# Altium project iA-Pmod-AES3-4x4.PrjPcb (part 1 of 2)
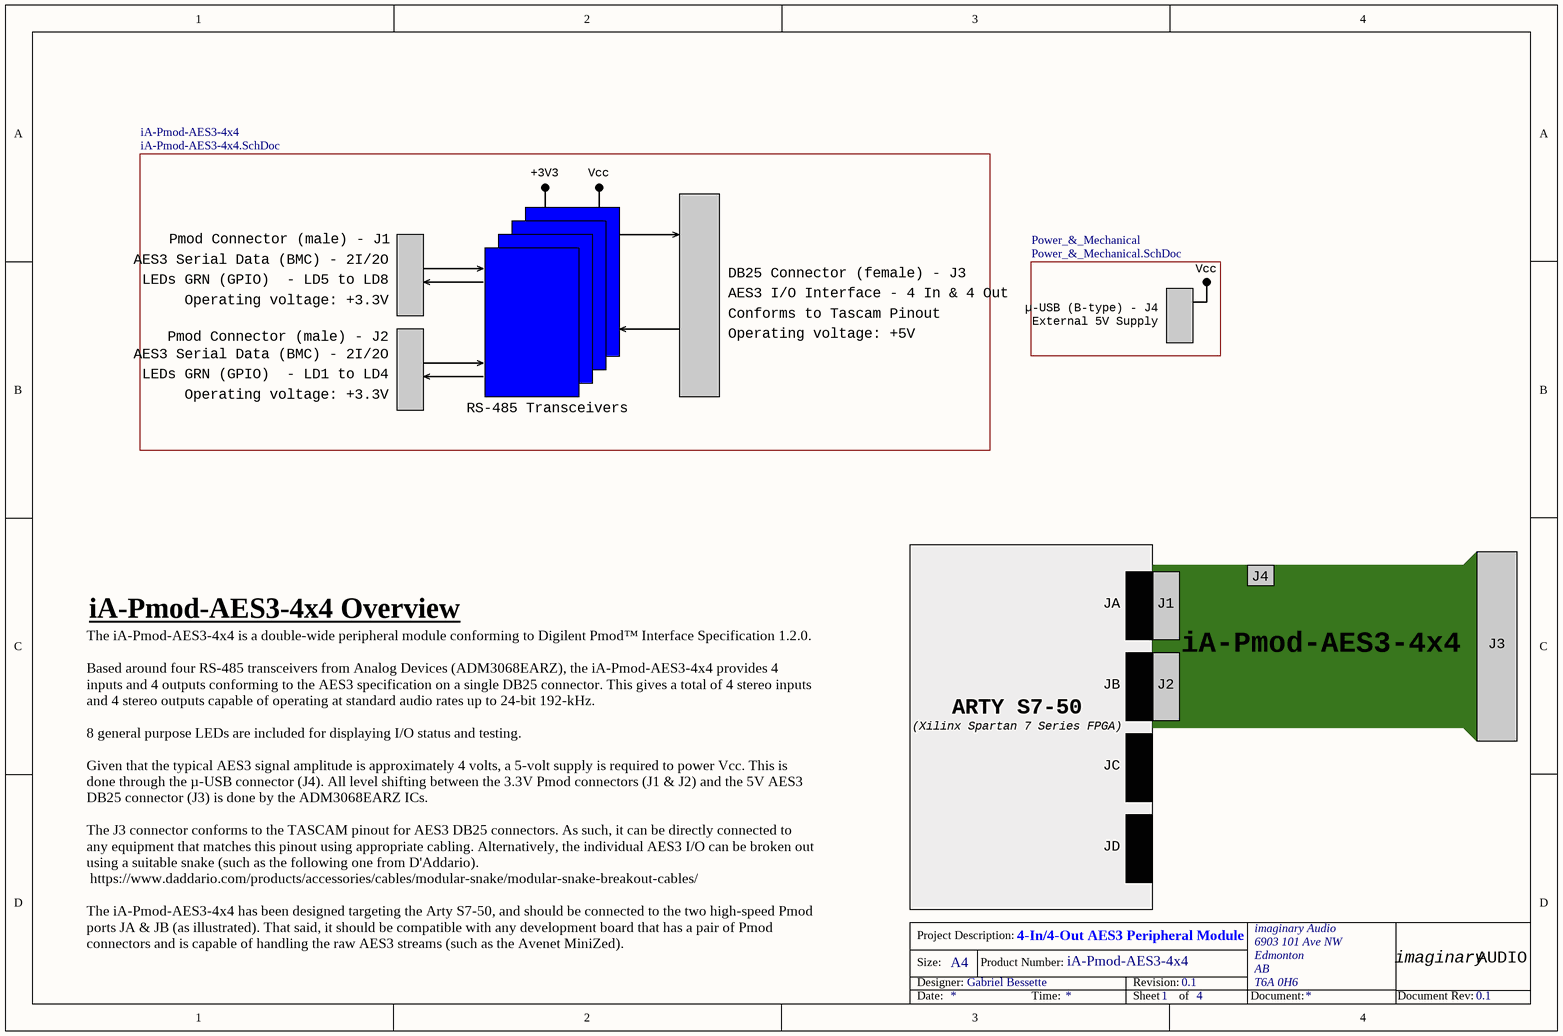
[diagram p0: iA-Pmod-AES3-4x4_Overview.SchDoc]
PartNumberPCBA: iA-Pmod-AES3-4x4; ProductNumber: iA-Pmod-AES3-4x4; ProductRevision: 0.1; ProjectDescription: 4-In/4-Out AES3 Peripheral Module
4 sheets, 124 parts. Net scope: flat (ports and power ports of the same name join across sheets).
Board file: iA-Pmod-AES3-4x4.PcbDoc
Sheets:
  iA-Pmod-AES3-4x4_Overview.SchDoc
    iA-Pmod-AES3-4x4 = iA-Pmod-AES3-4x4.SchDoc
      IO1 = AES3_Transceiver.SchDoc
      IO2 = AES3_Transceiver.SchDoc
      IO3 = AES3_Transceiver.SchDoc
      IO4 = AES3_Transceiver.SchDoc
    Power_&_Mechanical = Power_&_Mechanical.SchDoc

## Sheet iA-Pmod-AES3-4x4_Overview.SchDoc
size A4; CompanyName: imaginary Audio; Organization: imaginary Audio; Address1: 6903 101 Ave NW; Address2: Edmonton; Address3: AB; Address4: T6A 0H6; DocumentNumber: 1; Revision: 0.1; SheetNumber: 1; SheetTotal: 4; Designer: Gabriel Bessette; DocRev: 0.1

### Sub-sheets
iA-Pmod-AES3-4x4 = iA-Pmod-AES3-4x4.SchDoc: no entries
Power_&_Mechanical = Power_&_Mechanical.SchDoc: no entries

### Notes on the sheet
- +3V3
- Vcc
- Pmod Connector (male) - J1
- AES3 Serial Data (BMC) - 2I/2O
- Operating voltage: +3.3V
- LEDs GRN (GPIO)  - LD5 to LD8
- DB25 Connector (female) - J3
- AES3 I/O Interface - 4 In & 4 Out
- µ-USB (B-type) - J4
- Pmod Connector (male) - J2
- LEDs GRN (GPIO)  - LD1 to LD4
- Conforms to Tascam Pinout
- Operating voltage: +5V
- External 5V Supply
- RS-485 Transceivers
- J4
- iA-Pmod-AES3-4x4 Overview
- JA
- J1
- iA-Pmod-AES3-4x4
- J3
- ARTY S7-50
- JB
- J2
- (Xilinx Spartan 7 Series FPGA)
- JC
- JD
- The iA-Pmod-AES3-4x4 is a double-wide peripheral module conforming to Digilent Pmod™ Interface Specification 1.2.0.
  Based around four RS-485 transceivers from Analog Devices (ADM3068EARZ), the iA-Pmod-AES3-4x4 provides 4 inputs and 4 outputs conforming to the AES3 specification on a single DB25 connector. This gives a total of 4 stereo inputs and 4 stereo outputs capable of operating at standard audio rates up to 24-bit 192-kHz.
  8 general purpose LEDs are included for displaying I/O status and testing.
  Given that the typical AES3 signal amplitude is approximately 4 volts, a 5-volt supply is required to power Vcc. This is done through the µ-USB connector (J4). All level shifting between the 3.3V Pmod connectors (J1 & J2) and the 5V AES3 DB25 connector (J3) is done by the ADM3068EARZ ICs.
  The J3 connector conforms to the TASCAM pinout for AES3 DB25 connectors. As such, it can be directly connected to any equipment that matches this pinout using appropriate cabling. Alternatively, the individual AES3 I/O can be broken out using a suitable snake (such as the following one from D'Addario).
  https://www.daddario.com/products/accessories/cables/modular-snake/modular-snake-breakout-cables/
  The iA-Pmod-AES3-4x4 has been designed targeting the Arty S7-50, and should be connected to the two high-speed Pmod ports JA & JB (as illustrated). That said, it should be compatible with any development board that has a pair of Pmod connectors and is capable of handling the raw AES3 streams (such as the Avenet MiniZed).
- Project Description:
- Size:
- Designer:
- A4
- Product Number:
- Revision:
- imaginary
- AUDIO
- Date:
- Time:
- Sheet
- of
- Document:
- Document Rev:

## Sheet iA-Pmod-AES3-4x4.SchDoc
size A4; CompanyName: imaginary Audio; Organization: imaginary Audio; Address1: 6903 101 Ave NW; Address2: Edmonton; Address3: AB; Address4: T6A 0H6; DocumentNumber: 2; Revision: 0.1; SheetNumber: 2; SheetTotal: 4; Designer: Gabriel Bessette; DocRev: 0.1
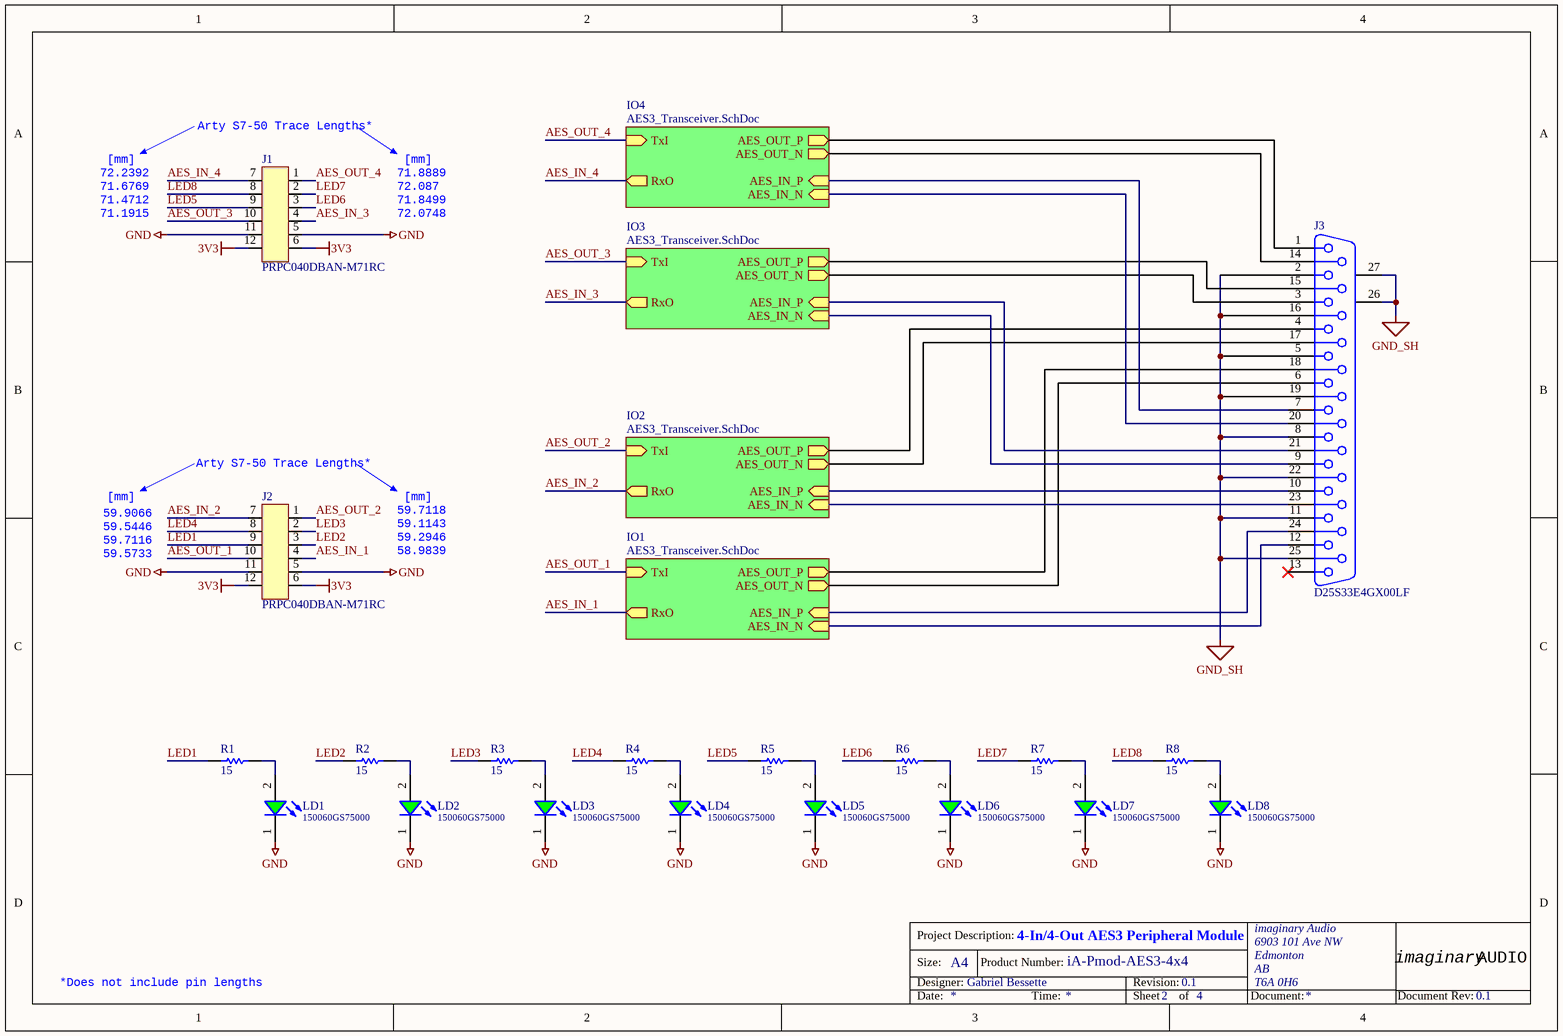
[diagram p1: iA-Pmod-AES3-4x4.SchDoc]

### Parts
J1  PRPC040DBAN-M71RC  [HDRMTH100RA_6x2]
J2  PRPC040DBAN-M71RC  [HDRMTH100RA_6x2]
J3  D25S33E4GX00LF  [D25S33E4GX00LF]
LD1  150060GS75000  [WL-SMCW_0603_H=0.7mm]
LD2  150060GS75000  [WL-SMCW_0603_H=0.7mm]
LD3  150060GS75000  [WL-SMCW_0603_H=0.7mm]
LD4  150060GS75000  [WL-SMCW_0603_H=0.7mm]
LD5  150060GS75000  [WL-SMCW_0603_H=0.7mm]
LD6  150060GS75000  [WL-SMCW_0603_H=0.7mm]
LD7  150060GS75000  [WL-SMCW_0603_H=0.7mm]
LD8  150060GS75000  [WL-SMCW_0603_H=0.7mm]
R1  15  [RESC1608X55X30NL15T15]
R2  15  [RESC1608X55X30NL15T15]
R3  15  [RESC1608X55X30NL15T15]
R4  15  [RESC1608X55X30NL15T15]
R5  15  [RESC1608X55X30NL15T15]
R6  15  [RESC1608X55X30NL15T15]
R7  15  [RESC1608X55X30NL15T15]
R8  15  [RESC1608X55X30NL15T15]

### Sub-sheets
IO1 = AES3_Transceiver.SchDoc: AES_IN_P (in), AES_IN_N (in), AES_OUT_N (out), AES_OUT_P (out), TxI (in), RxO (out)
IO2 = AES3_Transceiver.SchDoc: AES_IN_P (in), AES_IN_N (in), AES_OUT_N (out), AES_OUT_P (out), TxI (in), RxO (out)
IO3 = AES3_Transceiver.SchDoc: AES_IN_P (in), AES_IN_N (in), AES_OUT_N (out), AES_OUT_P (out), TxI (in), RxO (out)
IO4 = AES3_Transceiver.SchDoc: AES_IN_P (in), AES_IN_N (in), AES_OUT_N (out), AES_OUT_P (out), TxI (in), RxO (out)

### Nets
3V3: J1.6 J1.12 J2.6 J2.12
GND: J1.5 J1.11 J2.5 J2.11 LD1.1(K) LD2.1(K) LD3.1(K) LD4.1(K) LD5.1(K) LD6.1(K) LD7.1(K) LD8.1(K)
GND_SH: J3.2 J3.5 J3.8 J3.11 J3.16 J3.19 J3.22 J3.25 J3.26(MH1) J3.27(MH2)
AES_IN_1: J2.4 ; sheet IO1/RxO
AES_IN_2: J2.7 ; sheet IO2/RxO
AES_IN_3: J1.4 ; sheet IO3/RxO
AES_IN_4: J1.7 ; sheet IO4/RxO
AES_OUT_1: J2.10 ; sheet IO1/TxI
AES_OUT_2: J2.1 ; sheet IO2/TxI
AES_OUT_3: J1.10 ; sheet IO3/TxI
AES_OUT_4: J1.1 ; sheet IO4/TxI
LED1: J2.9 R1.1
LED2: J2.3 R2.1
LED3: J2.2 R3.1
LED4: J2.8 R4.1
LED5: J1.9 R5.1
LED6: J1.3 R6.1
LED7: J1.2 R7.1
LED8: J1.8 R8.1
NetJ3_1: J3.1 ; sheet IO4/AES_OUT_P
NetJ3_3: J3.3 ; sheet IO3/AES_OUT_N
NetJ3_4: J3.4 ; sheet IO2/AES_OUT_P
NetJ3_6: J3.6 ; sheet IO1/AES_OUT_N
NetJ3_7: J3.7 ; sheet IO4/AES_IN_P
NetJ3_9: J3.9 ; sheet IO3/AES_IN_N
NetJ3_10: J3.10 ; sheet IO2/AES_IN_P
NetJ3_12: J3.12 ; sheet IO1/AES_IN_N
NetJ3_14: J3.14 ; sheet IO4/AES_OUT_N
NetJ3_15: J3.15 ; sheet IO3/AES_OUT_P
NetJ3_17: J3.17 ; sheet IO2/AES_OUT_N
NetJ3_18: J3.18 ; sheet IO1/AES_OUT_P
NetJ3_20: J3.20 ; sheet IO4/AES_IN_N
NetJ3_21: J3.21 ; sheet IO3/AES_IN_P
NetJ3_23: J3.23 ; sheet IO2/AES_IN_N
NetJ3_24: J3.24 ; sheet IO1/AES_IN_P
NetLD1_2: LD1.2(A) R1.2
NetLD2_2: LD2.2(A) R2.2
NetLD3_2: LD3.2(A) R3.2
NetLD4_2: LD4.2(A) R4.2
NetLD5_2: LD5.2(A) R5.2
NetLD6_2: LD6.2(A) R6.2
NetLD7_2: LD7.2(A) R7.2
NetLD8_2: LD8.2(A) R8.2

Not connected (* = marked no-connect by the designer): J3 13*

### Notes on the sheet
- 72.2392
- [mm]
- (near J1) Arty S7-50 Trace Lengths*
- 71.8889
- 71.6769
- 71.4712
- 71.1915
- 72.087
- 71.8499
- 72.0748
- 59.9066
- (near J2) Arty S7-50 Trace Lengths*
- 59.7118
- 59.5446
- 59.7116
- 59.5733
- 59.1143
- 59.2946
- 58.9839
- *Does not include pin lengths
- Project Description:
- Size:
- Designer:
- A4
- Product Number:
- Revision:
- imaginary
- AUDIO
- Date:
- Time:
- Sheet
- of
- Document:
- Document Rev:

### Library data of the parts
J1 J2 = HDRMTH100RA_6X2: CONN HEADER .100 DUAL R/A 80POS; Manufacturer: Sullins; Number of Positions: 80; Connector Type: Male Pin; Pitch: 0.1inch; Supplier 1: Digi-Key; Supplier Part Number 1: S2111EC-40-ND; Manufacturer Part Number: PRPC040DBAN-M71RC; RoHS: Yes; Category: Connectors; Stock 1: 9670; Pricing 1: 1=2.43000, 10=2.17100, 100=1.78790, 500=1.41332, 1000=1.22980 (USD); Mount: Through Hole; Contact Plating: Gold; Color: Black; Termination: Solder; Package Quantity: 1; Number of Rows: 2; Packaging: Bulk; Row Spacing: 0.1inch; Contact Mating Length: 0.23inch; Lead Free: Lead Free; ComponentLink1URL: https://datasheet.ciiva.com/16477/prpc040sban-m71rc-16477642.pdf?src-supplier=Future+Electronics; ComponentLink1Description: https://datasheet.ciiva.com/16477/prpc040sban-m71rc-16477642.pdf?src-supplier=Future+Electronics; ComponentLink2URL: https://datasheet.ciiva.com/741/xrxczzzdxxn-m71rc-11639-b-741645.pdf?src-supplier=Digi-Key; ComponentLink2Description: https://datasheet.ciiva.com/741/xrxczzzdxxn-m71rc-11639-b-741645.pdf?src-supplier=Digi-Key
J3 = D25S33E4GX00LF: CONN, D-SUB RCPT 25POS R/A SOLDER; Manufacturer: Amphenol FCI; Gender: Receptacle; Connector Type: D-Sub,Receptacle,Signal; Voltage Rating: 300V; Current Rating: 5A; Number of Positions: 25; Number of Ports: 1; Pitch: 2.84mm; Body Material: Metal; Mating Cycles: 200; PackageDocument: U; Plating: Tin,Bright; Supplier 1: Digi-Key; Supplier Part Number 1: 609-1511-ND; RoHS: Yes; Category: D-Sub Connectors; Stock 1: 371; Pricing 1: 1=2.14000, 10=1.93800, 25=1.81920, 50=1.74020, 100=1.66110, 250=1.50292, 500=1.38426, 1000=1.18650, 2500=1.10740 (USD); Manufacturer Part Number: D25S33E4GX00LF; Publisher: Altium Limited; Orientation: Right Angle; Mount: Through Hole; Case/Package: Metal; Contact Plating: Gold,Tin,Matte; Housing Material: PBT; Color: Black; Contact Material: Copper Alloy; Number of Terminals: 25; Min Operating Temperature: -55°C; Max Operating Temperature: 125°C; Packaging: Tray; Number of Rows: 2; Termination: Solder; Number of Contacts: 25; Package Quantity: 20; Max Voltage Rating (AC): 300V; Length: 53.03mm; Depth: 18.77mm; Width: 12.55mm; Radiation Hardening: No; REACH SVHC: No SVHC; Lead Free: Lead Free; Flammability Rating: UL94 V-0; ComponentLink1URL: https://datasheet.ciiva.com/15177/getdatasheetpartid-136448-15177660.pdf?src-supplier=Verical; ComponentLink1Description: https://datasheet.ciiva.com/15177/getdatasheetpartid-136448-15177660.pdf?src-supplier=Verical; ComponentLink2URL: https://datasheet.ciiva.com/16662/c01-8646-0823-16662565.pdf?src-supplier=Avnet+Europe; ComponentLink2Description: https://datasheet.ciiva.com/16662/c01-8646-0823-16662565.pdf?src-supplier=Avnet+Europe; ComponentLink3URL: https://datasheet.ciiva.com/658/c01-8646-0146-658755.pdf?src-supplier=Digi-Key; ComponentLink3Description: https://datasheet.ciiva.com/658/c01-8646-0146-658755.pdf?src-supplier=Digi-Key; Supplier 2: Mouser; Supplier Part Number 2: 649-D25S33E4GX00LF; DatasheetDocument: 19-Mar-1999; Housing Color: Black; LatestRevisionDate: 17-Jul-2002; LatestRevisionNote: Re-released for DXP Platform.; Max Supply Voltage (AC): 300V; PackageReference: 787202; Positions: 25; Published: 15-Jun-2001
LD1-LD8 = 150060GS75000: WURTH ELEKTRONIK - 150060GS75000 - LED, Green, 520 nm, 3.2 V, 30 mA, 430 mcd RoHS Compliant: Yes; Manufacturer: Wurth Electronics; Viewing Angle: 140deg; Chip Technology: InGaN; Dominant Wavelength typ.: 525nm; Forward Voltage typ.: 3.2V; Luminous Intensity typ.: 430mcd; Peak Wavelength typ.: 515nm; Wavelength: 520nm; Lens Style: Clear,Rectangular; Forward Current: 30mA; Test Current: 20mA; ComponentLink1Description: Manufacturer; ComponentLink1URL: http://www.we-online.de; ComponentLink2URL: https://www.we-online.com/catalog/datasheet/150060GS75000.pdf; ComponentLink2Description: Datasheet; Emitting Color: Green; Mounting Technology: SMT; Operating Temperature: -40 to +85degC; Published Date: December 2019; Part Number: 150060GS75000; Packaging: Tape and Reel; Size: 0603; Publisher: Wurth Elektronik; Supplier 1: Digi-Key; Supplier Part Number 1: 732-4971-1-ND; RoHS: Yes; Category: LEDs; Stock 1: 95740; Pricing 1: 1=0.14000, 50=0.13300, 100=0.11400, 500=0.09900 (USD); Mount: Surface Mount; Case/Package: 0603; Color: Green; Case Code (Metric): 1608; Case Code (Imperial): 0603; Min Operating Temperature: -40°C; Max Operating Temperature: 85°C; Package Quantity: 4000; Luminous Intensity: 430mcd; Forward Voltage: 3.2V; Dominant Wavelength: 520nm; Length: 1.6mm; Width: 0.8mm; Height: 0.7mm; REACH SVHC: Unknown; Lead Free: Lead Free; ComponentLink3URL: https://datasheet.ciiva.com/29562/150060gs75000-29562868.pdf?src-supplier=Digi-Key; ComponentLink3Description: https://datasheet.ciiva.com/29562/150060gs75000-29562868.pdf?src-supplier=Digi-Key; ComponentLink4URL: https://datasheet.ciiva.com/29279/759427-da-01-en-chipled-0603-w-kl-gruen-150060gs75000-29279201.pdf?src-supplier=Conrad; ComponentLink4Description: https://datasheet.ciiva.com/29279/759427-da-01-en-chipled-0603-w-kl-gruen-150060gs75000-29279201.pdf?src-supplier=Conrad; ComponentLink5URL: https://datasheet.ciiva.com/29562/150060gs75000-29562870.pdf?src-supplier=Digi-Key; ComponentLink5Description: https://datasheet.ciiva.com/29562/150060gs75000-29562870.pdf?src-supplier=Digi-Key; ComponentLink6URL: https://datasheet.ciiva.com/29562/150060gs75000-29562869.pdf?src-supplier=Digi-Key; ComponentLink6Description: https://datasheet.ciiva.com/29562/150060gs75000-29562869.pdf?src-supplier=Digi-Key; Supplier 2: Mouser; Supplier Part Number 2: 710-150060GS75000; Manufacturer Part Number: 150060GS75000
R1-R8 = RES: Res Thick Film 0603 15 Ohm 1% 1/10W ±100ppm/°C Molded SMD Punched Carrier T/R; Manufacturer Part Number: ERJ-3EKF15R0V; Resistance: 15R; Power Rating: 100mW; Voltage Rating: 75V; Value: 15; Supplier 1: Digi-Key; Supplier Part Number 1: P15.0HCT-ND; RoHS: Yes; Category: Chip SMD Resistors; Stock 1: 4368; Pricing 1: 1=0.10000, 10=0.03200, 100=0.01300, 1000=0.00583, 2500=0.00506 (USD); Mount: Surface Mount; Case/Package: 0603; Number of Pins: 2; Case Code (Metric): 1608; Case Code (Imperial): 0603; Weight: 7.1E-05oz; Contact Plating: Tin; Min Operating Temperature: -55°C; Max Operating Temperature: 155°C; Packaging: Tape and Reel; Tolerance: 1%; Package Quantity: 1; Resistor Type: Thick Film; Number of Terminations: 2; Termination: SMD/SMT; Temperature Coefficient: 100ppm/°C; Max Power Dissipation: 100mW; Voltage Rating (DC): 75V; Working Voltage: 75V; Features: Automotive AEC-Q200; Length: 1.6mm; Width: 0.031inch; Height: 0.022inch; Depth: 0.8mm; Radiation Hardening: No; REACH SVHC: No SVHC; Military Standard: Not; Lead Free: Lead Free; ComponentLink1URL: https://datasheet.ciiva.com/46373/1678782-46373800.pdf?src-supplier=Element14; ComponentLink1Description: https://datasheet.ciiva.com/46373/1678782-46373800.pdf?src-supplier=Element14; ComponentLink2URL: https://datasheet.ciiva.com/5915/aoa0000ce2-5915293.pdf?src-supplier=Farnell; ComponentLink2Description: https://datasheet.ciiva.com/5915/aoa0000ce2-5915293.pdf?src-supplier=Farnell; ComponentLink3URL: https://datasheet.ciiva.com/22682/1678782-22682189.pdf?src-supplier=Element14; ComponentLink3Description: https://datasheet.ciiva.com/22682/1678782-22682189.pdf?src-supplier=Element14; ComponentLink4URL: https://datasheet.ciiva.com/46373/1678782-46373801.pdf?src-supplier=Element14; ComponentLink4Description: https://datasheet.ciiva.com/46373/1678782-46373801.pdf?src-supplier=Element14; ComponentLink5URL: https://datasheet.ciiva.com/16770/70260748-16770860.pdf?src-supplier=Allied+Electronics; ComponentLink5Description: https://datasheet.ciiva.com/16770/70260748-16770860.pdf?src-supplier=Allied+Electronics; ComponentLink6URL: https://datasheet.ciiva.com/30238/aoa0000ce2-30238940.pdf?src-supplier=Onlinecomponents.com; ComponentLink6Description: https://datasheet.ciiva.com/30238/aoa0000ce2-30238940.pdf?src-supplier=Onlinecomponents.com; ComponentLink7URL: https://datasheet.ciiva.com/9192/aoa0000ce2-9192958.pdf?src-supplier=Avnet; ComponentLink7Description: https://datasheet.ciiva.com/9192/aoa0000ce2-9192958.pdf?src-supplier=Avnet

## Sheet AES3_Transceiver.SchDoc
size A4; CompanyName: imaginary Audio; Organization: imaginary Audio; Address1: 6903 101 Ave NW; Address2: Edmonton; Address3: AB; Address4: T6A 0H6; DocumentNumber: 3; Revision: 0.1; SheetNumber: 3; SheetTotal: 4; Designer: Gabriel Bessette
Used 4 times, as channels iA-Pmod-AES3-4x4/IO1, iA-Pmod-AES3-4x4/IO2, iA-Pmod-AES3-4x4/IO3, iA-Pmod-AES3-4x4/IO4. Parts and nets are listed once, with the designators drawn on the sheet.
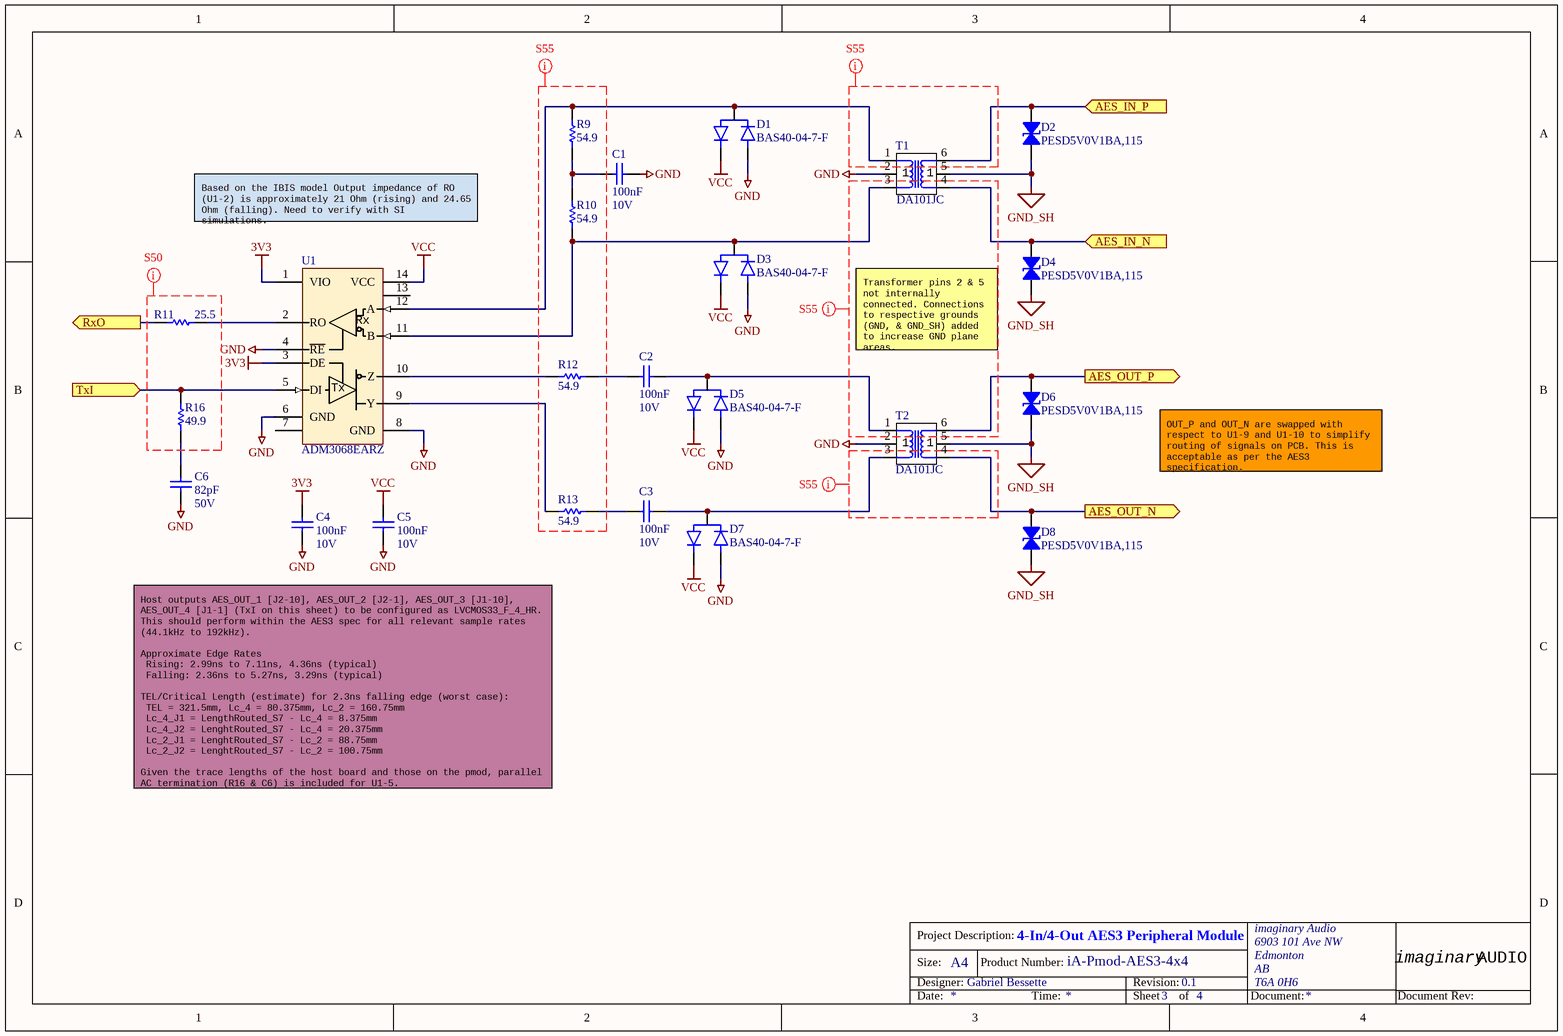
[diagram p2: AES3_Transceiver.SchDoc]

### Parts
C1  100nF  Voltage: 10V  [CAPC0603(1608)100_N]
C2  100nF  Voltage: 10V  [CAPC0603(1608)100_N]
C3  100nF  Voltage: 10V  [CAPC0603(1608)100_N]
C4  100nF  Voltage: 10V  [CAPC0603(1608)100_N]
C5  100nF  Voltage: 10V  [CAPC0603(1608)100_N]
C6  82pF  Voltage: 50V  [CAPC0603(1608)100_N]
D1  BAS40-04-7-F  [FP-SOT23-MFG]
D2  PESD5V0V1BA,115  [SOD323]
D3  BAS40-04-7-F  [FP-SOT23-MFG]
D4  PESD5V0V1BA,115  [SOD323]
D5  BAS40-04-7-F  [FP-SOT23-MFG]
D6  PESD5V0V1BA,115  [SOD323]
D7  BAS40-04-7-F  [FP-SOT23-MFG]
D8  PESD5V0V1BA,115  [SOD323]
R9  54.9  [RESC1608X55X30NL15T15]
R10  54.9  [RESC1608X55X30NL15T15]
R11  25.5  [RESC1608X55X30NL15T15]
R12  54.9  [RESC1608X55X30NL15T15]
R13  54.9  [RESC1608X55X30NL15T15]
R16  49.9  [RESC1608X55X30NL15T15]
T1  DA101JC  [DA101JC]
T2  DA101JC  [DA101JC]
U1  ADM3068EARZ  [SOIC127P600X175-14N]

### Ports
AES_IN_N (in), AES_IN_P (in), AES_OUT_N (out), AES_OUT_P (out), RxO (out), TxI (in)

### Nets
3V3: C4.2 U1.1(VIO) U1.3(DE)
GND: C1.2 C4.1 C5.1 C6.1 D1.1 D3.1 D5.1 D7.1 T1.2 T2.2 U1.4(~{RE}) U1.6(GND) U1.8(GND)
GND_SH: D2.2 D4.2 D6.2 D8.2 T1.5 T2.5
VCC: C5.2 D1.2 D3.2 D5.2 D7.2 U1.14(VCC)
AES_IN_N: D4.1 T1.4 ; port AES_IN_N
AES_IN_P: D2.1 T1.6 ; port AES_IN_P
AES_OUT_N: D8.1 T2.4 ; port AES_OUT_N
AES_OUT_P: D6.1 T2.6 ; port AES_OUT_P
RxO: R11.1 ; port RxO
TxI: R16.2 U1.5(DI) ; port TxI
NetC1_1: C1.1 R9.1 R10.2
NetC2_1: C2.1 R12.1
NetC2_2: C2.2 D5.3 T2.1
NetC3_1: C3.1 R13.1
NetC3_2: C3.2 D7.3 T2.3
NetC6_2: C6.2 R16.1
NetD1_3: D1.3 R9.2 T1.1 U1.12(A)
NetD3_3: D3.3 R10.1 T1.3 U1.11(B)
NetR11_2: R11.2 U1.2(RO)
NetR12_2: R12.2 U1.10(Z)
NetR13_2: R13.2 U1.9(Y)

Not connected (* = marked no-connect by the designer): U1 7(NIC) 13(NIC)

### Channels
iA-Pmod-AES3-4x4/IO1: designators end in A; ports AES_IN_N=NetD4A_1 AES_IN_P=NetD2A_1 AES_OUT_N=NetD8A_1 AES_OUT_P=NetD6A_1 RxO=NetR11A_1 TxI=NetR16A_2
iA-Pmod-AES3-4x4/IO2: designators end in B; ports AES_IN_N=NetD4A_1 AES_IN_P=NetD2A_1 AES_OUT_N=NetD8A_1 AES_OUT_P=NetD6A_1 RxO=NetR11A_1 TxI=NetR16A_2
iA-Pmod-AES3-4x4/IO3: designators end in C; ports AES_IN_N=NetD4A_1 AES_IN_P=NetD2A_1 AES_OUT_N=NetD8A_1 AES_OUT_P=NetD6A_1 RxO=NetR11A_1 TxI=NetR16A_2
iA-Pmod-AES3-4x4/IO4: designators end in D; ports AES_IN_N=NetD4A_1 AES_IN_P=NetD2A_1 AES_OUT_N=NetD8A_1 AES_OUT_P=NetD6A_1 RxO=NetR11A_1 TxI=NetR16A_2

### Layout directives
net class S55: (no net found under the mark)
net class S50: (no net found under the mark)

### Notes on the sheet
- Based on the IBIS model Output impedance of RO (U1-2) is approximately 21 Ohm (rising) and 24.65 Ohm (falling). Need to verify with SI simulations.
- (near D4) Transformer pins 2 & 5 not internally connected. Connections to respective grounds (GND, & GND_SH) added to increase GND plane areas.
- OUT_P and OUT_N are swapped with respect to U1-9 and U1-10 to simplify routing of signals on PCB. This is acceptable as per the AES3 specification.
- Host outputs AES_OUT_1 [J2-10], AES_OUT_2 [J2-1], AES_OUT_3 [J1-10], AES_OUT_4 [J1-1] (TxI on this sheet) to be configured as LVCMOS33_F_4_HR. This should perform within the AES3 spec for all relevant sample rates (44.1kHz to 192kHz).
  Approximate Edge Rates
  Rising: 2.99ns to 7.11ns, 4.36ns (typical)
  Falling: 2.36ns to 5.27ns, 3.29ns (typical)
  TEL/Critical Length (estimate) for 2.3ns falling edge (worst case):
  TEL = 321.5mm, Lc_4 = 80.375mm, Lc_2 = 160.75mm
  Lc_4_J1 = LengthRouted_S7 - Lc_4 = 8.375mm
  Lc_4_J2 = LenghtRouted_S7 - Lc_4 = 20.375mm
  Lc_2_J1 = LenghtRouted_S7 - Lc_2 = 88.75mm
  Lc_2_J2 = LenghtRouted_S7 - Lc_2 = 100.75mm
  Given the trace lengths of the host board and those on the pmod, parallel AC termination (R16 & C6) is included for U1-5.
- Project Description:
- Size:
- Designer:
- A4
- Product Number:
- Revision:
- imaginary
- AUDIO
- Date:
- Time:
- Sheet
- of
- Document:
- Document Rev:
- (in symbol ADM3068EARZ) Rx; Tx

### Library data of the parts
C1-C5 = CAP: KEMET - C0603C104K8RACTU - SMD Multilayer Ceramic Capacitor, 0.1 µF, 10 V, 0603 [1608 Metric], ± 10%, X7R, C Series KEMET; Dissipation Factor: 5%; Max Thickness: 1 mm; Value: 100nF; Technology: SMT; Supplier 1: Digi-Key; Supplier Part Number 1: 399-1095-1-ND; Manufacturer: KEMET; Manufacturer Part Number: C0603C104K8RACTU; RoHS: Yes; Category: Ceramic Capacitors; Stock 1: 795093; Pricing 1: 1=0.12000, 10=0.08500, 50=0.04860, 100=0.04020, 500=0.02818, 1000=0.02333 (USD); Mount: Surface Mount,PCB; Case/Package: 0603; Number of Pins: 2; Case Code (Imperial): 0603; Case Code (Metric): 1608; Contact Plating: Tin,Matte; Dielectric Material: Ceramic; Min Operating Temperature: -55°C; Max Operating Temperature: 125°C; Capacitance: 100nF; Tolerance: 10%; Voltage Rating: 10V; Packaging: Tape and Reel; Package Quantity: 1; Voltage Rating (DC): 10V; Dielectric: X7R; Termination: SMD/SMT; Length: 1.6mm; Height: 0.8mm; Width: 0.8mm; Lead Pitch: 0.7mm; Thickness: 0.034inch; Depth: 0.8mm; Radiation Hardening: No; REACH SVHC: No SVHC; ComponentLink1URL: https://datasheet.ciiva.com/6093/1776114-6093269.pdf?src-supplier=Farnell; ComponentLink1Description: https://datasheet.ciiva.com/6093/1776114-6093269.pdf?src-supplier=Farnell; ComponentLink2URL: https://datasheet.ciiva.com/7823/kem-c1002-x7r-smd-7823989.pdf?src-supplier=Element14; ComponentLink2Description: https://datasheet.ciiva.com/7823/kem-c1002-x7r-smd-7823989.pdf?src-supplier=Element14; ComponentLink3URL: https://datasheet.ciiva.com/18192/getdatasheetpartid-91529-18192711.pdf?src-supplier=Verical; ComponentLink3Description: https://datasheet.ciiva.com/18192/getdatasheetpartid-91529-18192711.pdf?src-supplier=Verical; ComponentLink4URL: https://datasheet.ciiva.com/5419/kem-c1002-x7r-smd-357932-5419657.pdf?src-supplier=Mouser; ComponentLink4Description: https://datasheet.ciiva.com/5419/kem-c1002-x7r-smd-357932-5419657.pdf?src-supplier=Mouser; ComponentLink5URL: https://datasheet.ciiva.com/14589/70095383-14589402.pdf?src-supplier=Allied+Electronics; ComponentLink5Description: https://datasheet.ciiva.com/14589/70095383-14589402.pdf?src-supplier=Allied+Electronics; ComponentLink6URL: https://datasheet.ciiva.com/14593/70095383-14593978.pdf?src-supplier=Allied+Electronics; ComponentLink6Description: https://datasheet.ciiva.com/14593/70095383-14593978.pdf?src-supplier=Allied+Electronics
C6 = CAP: KEMET - C0603C820J5GACTU - Keramikvielschichtkondensator, SMD, 82 pF, 50 V, 0603 [Metrisch 1608], ± 5%, C0G / NP0; Dielectric Material: Ceramic; Temperature Coefficient: 30ppm/°C; Dissipation Factor: 0.1%; Max Thickness: 1 mm; Value: 82pF; Technology: SMT; Supplier 1: Digi-Key; Supplier Part Number 1: 399-1060-1-ND; Manufacturer: KEMET; Manufacturer Part Number: C0603C820J5GACTU; RoHS: Yes; Category: Ceramic Capacitors; Stock 1: 36463; Pricing 1: 1=0.10000, 10=0.05300, 50=0.02900, 100=0.02370, 500=0.01694, 1000=0.01331 (USD); Mount: Surface Mount,PCB; Case/Package: 0603; Number of Pins: 2; Case Code (Metric): 1608; Case Code (Imperial): 0603; Contact Material: Tin; Min Operating Temperature: -55°C; Max Operating Temperature: 125°C; Package Quantity: 1; Capacitance: 82pF; Voltage Rating: 50V; Tolerance: 5%; Packaging: Tape and Reel; Voltage Rating (DC): 50V; Dielectric: C0G; Termination: SMD/SMT; Length: 1.6mm; Width: 0.031inch; Height: 0.8mm; Thickness: 0.034inch; Lead Pitch: 0.7mm; Depth: 0.8mm; Radiation Hardening: No; REACH SVHC: No SVHC; Lead Free: Lead Free; ComponentLink1URL: https://datasheet.ciiva.com/144/docfinderpartnumber-c0603c820j5gactu-144400.pdf?src-supplier=Digi-Key; ComponentLink1Description: https://datasheet.ciiva.com/144/docfinderpartnumber-c0603c820j5gactu-144400.pdf?src-supplier=Digi-Key; ComponentLink2URL: https://datasheet.ciiva.com/26948/getdatasheetpartid-385592-26948455.pdf?src-supplier=Verical; ComponentLink2Description: https://datasheet.ciiva.com/26948/getdatasheetpartid-385592-26948455.pdf?src-supplier=Verical; ComponentLink3URL: https://datasheet.ciiva.com/28696/1789732-28696009.pdf?src-supplier=Element14; ComponentLink3Description: https://datasheet.ciiva.com/28696/1789732-28696009.pdf?src-supplier=Element14; ComponentLink4URL: https://datasheet.ciiva.com/5420/kem-c1003-c0g-smd-356956-5420651.pdf?src-supplier=Mouser; ComponentLink4Description: https://datasheet.ciiva.com/5420/kem-c1003-c0g-smd-356956-5420651.pdf?src-supplier=Mouser; ComponentLink5URL: https://datasheet.ciiva.com/22705/1907778-22705499.pdf?src-supplier=Element14; ComponentLink5Description: https://datasheet.ciiva.com/22705/1907778-22705499.pdf?src-supplier=Element14; ComponentLink6URL: https://datasheet.ciiva.com/7823/40889-7823855.pdf?src-supplier=Element14; ComponentLink6Description: https://datasheet.ciiva.com/7823/40889-7823855.pdf?src-supplier=Element14
D1 D3 D5 D7 = BAS40-04-7-F: DIODE SCHOTTKY 40V 350MW SOT23-3; Manufacturer: Diodes Inc.; Automotive Grade: Grade 1; Forward Current: 200mA; Max Junction Temp: +125°C; Peak Reverse Current: 0.02uA; VALUE: 4pF; Standoff Height: 0.013mm; Max Surge Forward Current: 600mA; Reverse Recovery Time: 5ns; Max Reverse Current: 200nA; Forward Voltage: 1V; ComponentLink2Description: Datasheet; Temperature Range High: +125°C; Mouser Description: Schottky Diodes & Rectifiers 40V 350mW; Reverse Voltage: 40V; Device Class L3: Schottky Diodes; Package: SOT23; Automotive: Yes; Max Repetitive Reverse Voltage: 40V; Height: 1.1mm; RoHS: TRUE; Device Class L1: Discrete Semiconductors; Temperature Range Low: -55°C; Digikey Description: DIODE ARRAY SCHOTTKY 40V SOT23-3; Lead Free: Yes; Category: Diode; Octopart: https://octopart.com/bas40-04-7-f-diodes+inc.-325979; Device Class L2: Diodes; Capacitance: 4pF; ComponentLink2URL: https://www.diodes.com/assets/Datasheets/ds11006.pdf; Manufacturer Part Number: BAS40-04-7-F; Footprint Url: https://www.diodes.com/assets/Package-Files/SOT23.pdf; Temperature: -55°C to +125°C; Supplier 1: Digi-Key; Supplier Part Number 1: BAS40-04FDICT-ND; Stock 1: 246869; Pricing 1: 1=0.21000, 10=0.17400, 100=0.07110, 500=0.05930, 1000=0.04121 (USD); Mount: Surface Mount; Case/Package: SOT-23; Number of Pins: 3; Weight: 0.000282oz; Contact Plating: Tin,Matte; Min Operating Temperature: -55°C; Max Operating Temperature: 125°C; Max Repetitive Reverse Voltage (Vrrm): 40V; Peak Non-Repetitive Surge Current: 600mA; Package Quantity: 3000; Packaging: Tape and Reel; Max Power Dissipation: 350mW; Average Rectified Current: 200mA; Max Forward Surge Current (Ifsm): 600mA; Power Dissipation: 350mW; Power Rating: 350mW; Max Reverse Voltage (DC): 40V; Termination: SMD/SMT; Length: 3.05mm; Width: 1.4mm; Radiation Hardening: No; REACH SVHC: No SVHC; ComponentLink1URL: https://datasheet.ciiva.com/25946/ds11006-25946962.pdf?src-supplier=Avnet+Europe; ComponentLink1Description: https://datasheet.ciiva.com/25946/ds11006-25946962.pdf?src-supplier=Avnet+Europe; ComponentLink3URL: https://datasheet.ciiva.com/1177/ds11006-1177656.pdf?src-supplier=Element14; ComponentLink3Description: https://datasheet.ciiva.com/1177/ds11006-1177656.pdf?src-supplier=Element14; ComponentLink4URL: https://datasheet.ciiva.com/22695/1911827-22695788.pdf?src-supplier=Element14; ComponentLink4Description: https://datasheet.ciiva.com/22695/1911827-22695788.pdf?src-supplier=Element14; ComponentLink5URL: https://datasheet.ciiva.com/16379/ds11006-16379065.pdf?src-supplier=Future+Electronics; ComponentLink5Description: https://datasheet.ciiva.com/16379/ds11006-16379065.pdf?src-supplier=Future+Electronics; ComponentLink6URL: https://datasheet.ciiva.com/8303/ds11006-8303212.pdf?src-supplier=Avnet; ComponentLink6Description: https://datasheet.ciiva.com/8303/ds11006-8303212.pdf?src-supplier=Avnet; ComponentLink7URL: https://datasheet.ciiva.com/4715/ds11006-4715662.pdf?src-supplier=Mouser; ComponentLink7Description: https://datasheet.ciiva.com/4715/ds11006-4715662.pdf?src-supplier=Mouser
D2 D4 D6 D8 = PESD5V0V1BA,115: TVS DIODE 5V 12.5V SOD323; Manufacturer: Nexperia USA Inc.; Bidirectional Channels: 1; Capacitance @ Frequency: 11pF @ 1MHz; Current - Peak Pulse (10/1000µs): 4.8A (8/20µs); Power Line Protection: No; Power - Peak Pulse: 45W; Type: Zener; Voltage - Breakdown (Min): 5.8V; Voltage - Reverse Standoff (Typ): 5V (Max); Part Number: PESD5V0V1BA,115; Applications: Automotive; ComponentLink1Description: Datasheet; ComponentLink1URL: https://assets.nexperia.com/documents/data-sheet/PESD5V0V1BA_BB_BL.pdf; ComponentLink2Description: DigiKey Link; ComponentLink2URL: http://digikey.com/product-detail/en/nexperia-usa-inc/PESD5V0V1BA115/1727-5807-1-ND/2697413; LastUpdated: 2020-09-02 1:28:29 AM; Lifecycle Status: Active; Minimum Order: 1; Mounting Type: Surface Mount; Operating Temperature: -55°C ~ 150°C (TA); Package / Case: SC-76, SOD-323; Packaging: TapeAndReel; PartId: 9963; Part Status: Active; Price: 0.07; Series: Automotive, AEC-Q101; Supplier 1: DigiKey; Supplier Part Number 1: 1727-5807-1-ND; Supplier Device Package: SOD-323; Voltage - Clamping (Max) @ Ipp: 12.5V
R9 R10 R12 R13 = RES: RES, THICK FILM, 54R9, 1%, 0.1W, 0603; Product Range:AEC-Q200 ERJ Series; Resistance:54.9ohm; Power Rating:100mW; Resistance Tolerance: 1%; Voltage Rating:75V; Resistor Case Style:0603 [1608 Metric]; Packaging:Cut Tape; MSL:- ;RoHS Compliant: Yes; Manufacturer Part Number: ERJ-3EKF54R9V; Resistance: 54.9R; Power Rating: 100mW; Voltage Rating: 75V; Temperature Coefficient: 100ppm/°C; Voltage Rating (DC): 50V; Value: 54.9; Supplier 1: Digi-Key; Supplier Part Number 1: P54.9HCT-ND; RoHS: Yes; Category: Chip SMD Resistors; Stock 1: 80631; Pricing 1: 1=0.10000, 10=0.03200, 100=0.01300, 1000=0.00583, 2500=0.00506 (USD); Mount: Surface Mount; Case/Package: 0603; Case Code (Imperial): 0603; Case Code (Metric): 1608; Contact Plating: Tin; Min Operating Temperature: -55°C; Max Operating Temperature: 155°C; Package Quantity: 1; Packaging: Tape and Reel; Tolerance: 1%; Resistor Type: Thick Film; Number of Terminations: 2; Max Power Dissipation: 100mW; Features: Automotive AEC-Q200; Length: 1.6mm; Height: 0.022inch; Width: 0.8mm; Depth: 0.8mm; REACH SVHC: No SVHC; Military Standard: Not; Lead Free: Lead Free; ComponentLink1URL: https://datasheet.ciiva.com/30100/aoa0000ce2-30100792.pdf?src-supplier=Onlinecomponents.com; ComponentLink1Description: https://datasheet.ciiva.com/30100/aoa0000ce2-30100792.pdf?src-supplier=Onlinecomponents.com; ComponentLink2URL: https://datasheet.ciiva.com/9188/aoa0000ce2-9188777.pdf?src-supplier=Avnet; ComponentLink2Description: https://datasheet.ciiva.com/9188/aoa0000ce2-9188777.pdf?src-supplier=Avnet; ComponentLink3URL: https://datasheet.ciiva.com/43460/426256-43460426.pdf?src-supplier=Farnell; ComponentLink3Description: https://datasheet.ciiva.com/43460/426256-43460426.pdf?src-supplier=Farnell; ComponentLink4URL: https://datasheet.ciiva.com/46388/426256-46388764.pdf?src-supplier=Element14; ComponentLink4Description: https://datasheet.ciiva.com/46388/426256-46388764.pdf?src-supplier=Element14
R11 = RES: RES SMD 25.5 OHM 1% 1/10W 0603; Manufacturer Part Number: ERJ-3EKF25R5V; Resistance: 25.5R; Power Rating: 100mW; Voltage Rating: 75V; Temperature Coefficient: 100ppm/°C; Voltage Rating (DC): 50V; Value: 25.5; Supplier 1: Digi-Key; Supplier Part Number 1: P25.5HCT-ND; RoHS: Yes; Category: Chip SMD Resistors; Stock 1: 195327; Pricing 1: 1=0.10000, 10=0.03200, 100=0.01300, 1000=0.00583, 2500=0.00506 (USD); Mount: Surface Mount; Case/Package: 0603; Case Code (Metric): 1608; Case Code (Imperial): 0603; Weight: 7.1E-05oz; Contact Plating: Tin; Min Operating Temperature: -55°C; Max Operating Temperature: 155°C; Tolerance: 1%; Packaging: Tape and Reel; Package Quantity: 1; Resistor Type: Thick Film; Number of Terminations: 2; Termination: SMD/SMT; Max Power Dissipation: 100mW; Features: Automotive AEC-Q200; Length: 0.063inch; Width: 0.031inch; Height: 0.022inch; REACH SVHC: Yes; Lead Free: Lead Free; ComponentLink1URL: https://datasheet.ciiva.com/46419/1678782-46419831.pdf?src-supplier=Element14; ComponentLink1Description: https://datasheet.ciiva.com/46419/1678782-46419831.pdf?src-supplier=Element14; ComponentLink2URL: https://datasheet.ciiva.com/22667/1678782-22667770.pdf?src-supplier=Element14; ComponentLink2Description: https://datasheet.ciiva.com/22667/1678782-22667770.pdf?src-supplier=Element14; ComponentLink3URL: https://datasheet.ciiva.com/30155/aoa0000ce2-30155996.pdf?src-supplier=Onlinecomponents.com; ComponentLink3Description: https://datasheet.ciiva.com/30155/aoa0000ce2-30155996.pdf?src-supplier=Onlinecomponents.com; ComponentLink4URL: https://datasheet.ciiva.com/7777/1678782-7777965.pdf?src-supplier=Element14; ComponentLink4Description: https://datasheet.ciiva.com/7777/1678782-7777965.pdf?src-supplier=Element14
R16 = RES: PANASONIC - ERJ-3EKF49R9V. - Resistor Case Style:0603 [1608 Metric]; Manufacturer Part Number: ERJ3EKF49R9V; Resistance: 49.9R; Tolerance: 1%; Temperature Coefficient: 100ppm/°C; Power Rating: 100mW; Voltage Rating: 75V; Voltage Rating (DC): 50V; Working Voltage: 6V; Value: 49.9; Supplier 1: Digi-Key; Supplier Part Number 1: P49.9HCT-ND; RoHS: Yes; Category: Chip SMD Resistors; Stock 1: 316454; Pricing 1: 1=0.10000, 10=0.03200, 100=0.01300, 1000=0.00583, 2500=0.00506 (USD); Mount: Surface Mount; Case/Package: 0603; Contact Plating: Tin; Case Code (Imperial): 0603; Case Code (Metric): 1608; Min Operating Temperature: -55°C; Max Operating Temperature: 155°C; Resistor Type: Thick Film; Packaging: Tape and Reel; Package Quantity: 5000; Number of Terminations: 2; Termination: SMD/SMT; Max Power Dissipation: 100mW; Features: Automotive AEC-Q200; Length: 1.6mm; Width: 0.8mm; Height: 0.022inch; Depth: 0.8mm; Radiation Hardening: No; REACH SVHC: Unknown; Military Standard: Not; Lead Free: Lead Free; ComponentLink1URL: https://datasheet.ciiva.com/9117/aoa0000ce2-9117128.pdf?src-supplier=Avnet; ComponentLink1Description: https://datasheet.ciiva.com/9117/aoa0000ce2-9117128.pdf?src-supplier=Avnet; ComponentLink2URL: https://datasheet.ciiva.com/16772/70260748-16772570.pdf?src-supplier=Allied+Electronics; ComponentLink2Description: https://datasheet.ciiva.com/16772/70260748-16772570.pdf?src-supplier=Allied+Electronics; ComponentLink3URL: https://datasheet.ciiva.com/28694/1678782-28694219.pdf?src-supplier=Element14; ComponentLink3Description: https://datasheet.ciiva.com/28694/1678782-28694219.pdf?src-supplier=Element14; ComponentLink4URL: https://datasheet.ciiva.com/46388/1678782-46388908.pdf?src-supplier=Element14; ComponentLink4Description: https://datasheet.ciiva.com/46388/1678782-46388908.pdf?src-supplier=Element14; ComponentLink5URL: https://datasheet.ciiva.com/16766/70260748-16766262.pdf?src-supplier=Allied+Electronics; ComponentLink5Description: https://datasheet.ciiva.com/16766/70260748-16766262.pdf?src-supplier=Allied+Electronics; ComponentLink6URL: https://datasheet.ciiva.com/30095/aoa0000ce2-30095355.pdf?src-supplier=Onlinecomponents.com; ComponentLink6Description: https://datasheet.ciiva.com/30095/aoa0000ce2-30095355.pdf?src-supplier=Onlinecomponents.com; ComponentLink7URL: https://datasheet.ciiva.com/48531/aoa0000ce2-48531019.pdf?src-supplier=Avnet; ComponentLink7Description: https://datasheet.ciiva.com/48531/aoa0000ce2-48531019.pdf?src-supplier=Avnet
T1 T2 = DA101JC: TRANS, Digital Audio 1:1 2000Vrms 6Term. Gull Wing SMD; Manufacturer: Murata; Inductance: 2.06mH; Isolation Voltage: 2kV; Inductance A: 1.6mH; Coupling Factor: 0.999; Supplier 1: Digi-Key; Supplier Part Number 1: 811-3121-ND; RoHS: Yes; Category: Uncategorized; Pricing 1: 1=1.57000, 10=1.55000, 25=1.53000, 50=1.50000, 100=1.42000, 250=1.32000, 500=1.24000, 1000=1.22360 (USD); Mount: Through Hole,Surface Mount; Number of Pins: 6; Weight: 0.032805oz; Min Operating Temperature: -40°C; Max Operating Temperature: 85°C; Turns Ratio: 1:1; Packaging: Rail/Tube; Package Quantity: 50; Lead/Base Style: Gull Wing; Termination: SMD/SMT; Length: 9.52mm; Height: 6.35mm; Width: 9mm; Height - Seated (Max): 6.35mm; Depth: 12.7mm; ComponentLink1URL: https://datasheet.ciiva.com/3293/kmp-da100j-3293148.pdf?src-supplier=Avnet; ComponentLink1Description: https://datasheet.ciiva.com/3293/kmp-da100j-3293148.pdf?src-supplier=Avnet; Supplier 2: Mouser; Supplier Part Number 2: 580-DA101JC; Manufacturer Part Number: DA101JC; Inductance B: 1.6mH
U1 = ADM3068EARZ: XCVR, Full-Duplex, RS-485, 50 Mbps; Manufacturer: Analog Devices; Supplier 1: Mouser; Supplier Part Number 1: 584-ADM3068EARZ; RoHS: No; Stock 1: 364; Pricing 1: 1=3.71000, 10=3.33000, 25=3.14000, 100=2.58000, 250=2.32000, 500=2.24000, 1000=1.88000, 2500=1.82000, 5000=1.77000 (USD); Supplier 2: Digi-Key; Supplier Part Number 2: 505-ADM3068EARZ-ND; Manufacturer Part Number: ADM3068EARZ